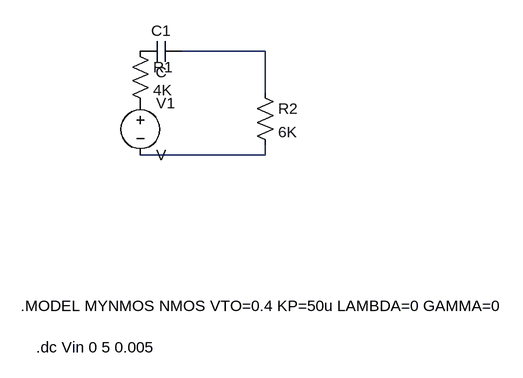
[diagram p0: schematic #4c.asc]
#4c.asc, the LTspice schematic file:
Version 4
SHEET 1 880 680
WIRE 288 32 160 32
WIRE 288 96 288 32
WIRE 288 192 288 176
WIRE 288 192 96 192
SYMBOL cap 96 16 M90
WINDOW 0 0 32 VBottom 2
WINDOW 3 32 32 VTop 2
SYMATTR InstName C1
SYMBOL res 80 16 R0
SYMATTR InstName R1
SYMATTR Value 4K
SYMBOL voltage 96 96 R0
SYMATTR InstName V1
SYMBOL res 272 80 R0
SYMATTR InstName R2
SYMATTR Value 6K
TEXT -88 424 Left 2 !.MODEL MYNMOS NMOS VTO=0.4 KP=50u LAMBDA=0 GAMMA=0
TEXT -64 488 Left 2 !.dc Vin 0 5 0.005

The netlist it stands for:
* #4c.asc
C1 P001 N001 C
R1 P001 P002 4K
V1 P002 N002 V
R2 N001 N002 6K
.MODEL MYNMOS NMOS VTO=0.4 KP=50u LAMBDA=0 GAMMA=0
.dc Vin 0 5 0.005
.backanno
.end